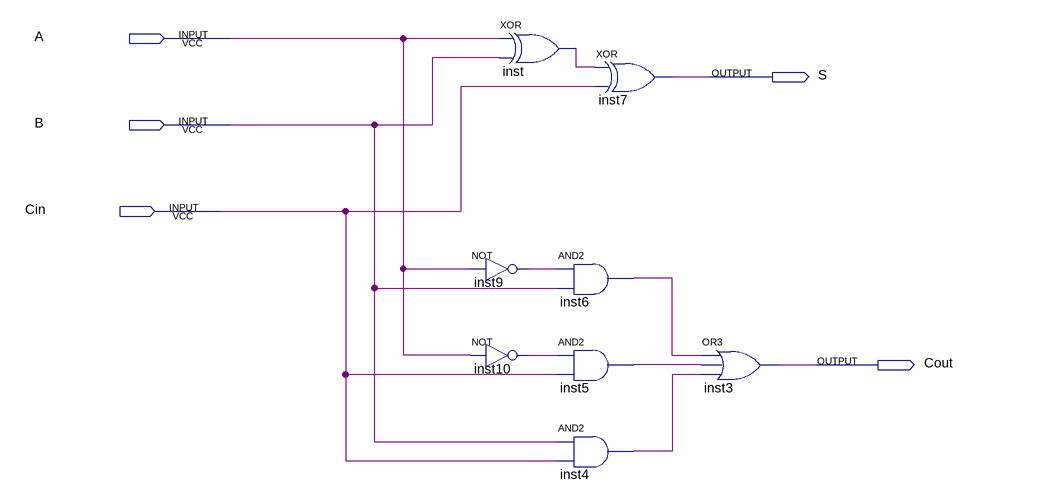
[diagram p0: schematic sheet]
// Quartus schematic subtrator.bdf as structural Verilog: 8 symbols, 5 pins
module subtrator (
  input  A,
  input  B,
  input  Cin,
  output S,
  output Cout
);

  wire inst4_out, inst5_out, inst6_out, inst9_out, inst10_out, inst_out;

  not inst9 (inst9_out, A);
  not inst10 (inst10_out, A);
  xor inst (inst_out, A, B);
  and inst6 (inst6_out, inst9_out, B);
  and inst5 (inst5_out, inst10_out, Cin);
  and inst4 (inst4_out, B, Cin);
  xor inst7 (S, inst_out, Cin);
  or inst3 (Cout, inst6_out, inst5_out, inst4_out);
endmodule
